# Altium schematic sheet 03_ARM_A.SchDoc: ARM Part A: EMIF / RAM
size 381 x 266 mm; Organization: Meteroi; Address1: Room 428, 410 Guiping Rd.; Address2: Shanghai 200233, CHINA; SheetNumber: 3; SheetTotal: 11; PageSetup: Record=PageOptions|CenterHorizontal=True|CenterVertical=True|PrintScale=0.75|XCorrection=1.00|YCorrection=1.00|PrintKind=2|BorderSize=5000000|LeftOffset=0|BottomOffset=0|Orientation=2|PaperLength=1000|PaperWidth=1000|Scale=100|PaperSource=276|PrintQuality=-3|MediaType=1|DitherType=10|PaperKind=A4|PrintScaleMode=1
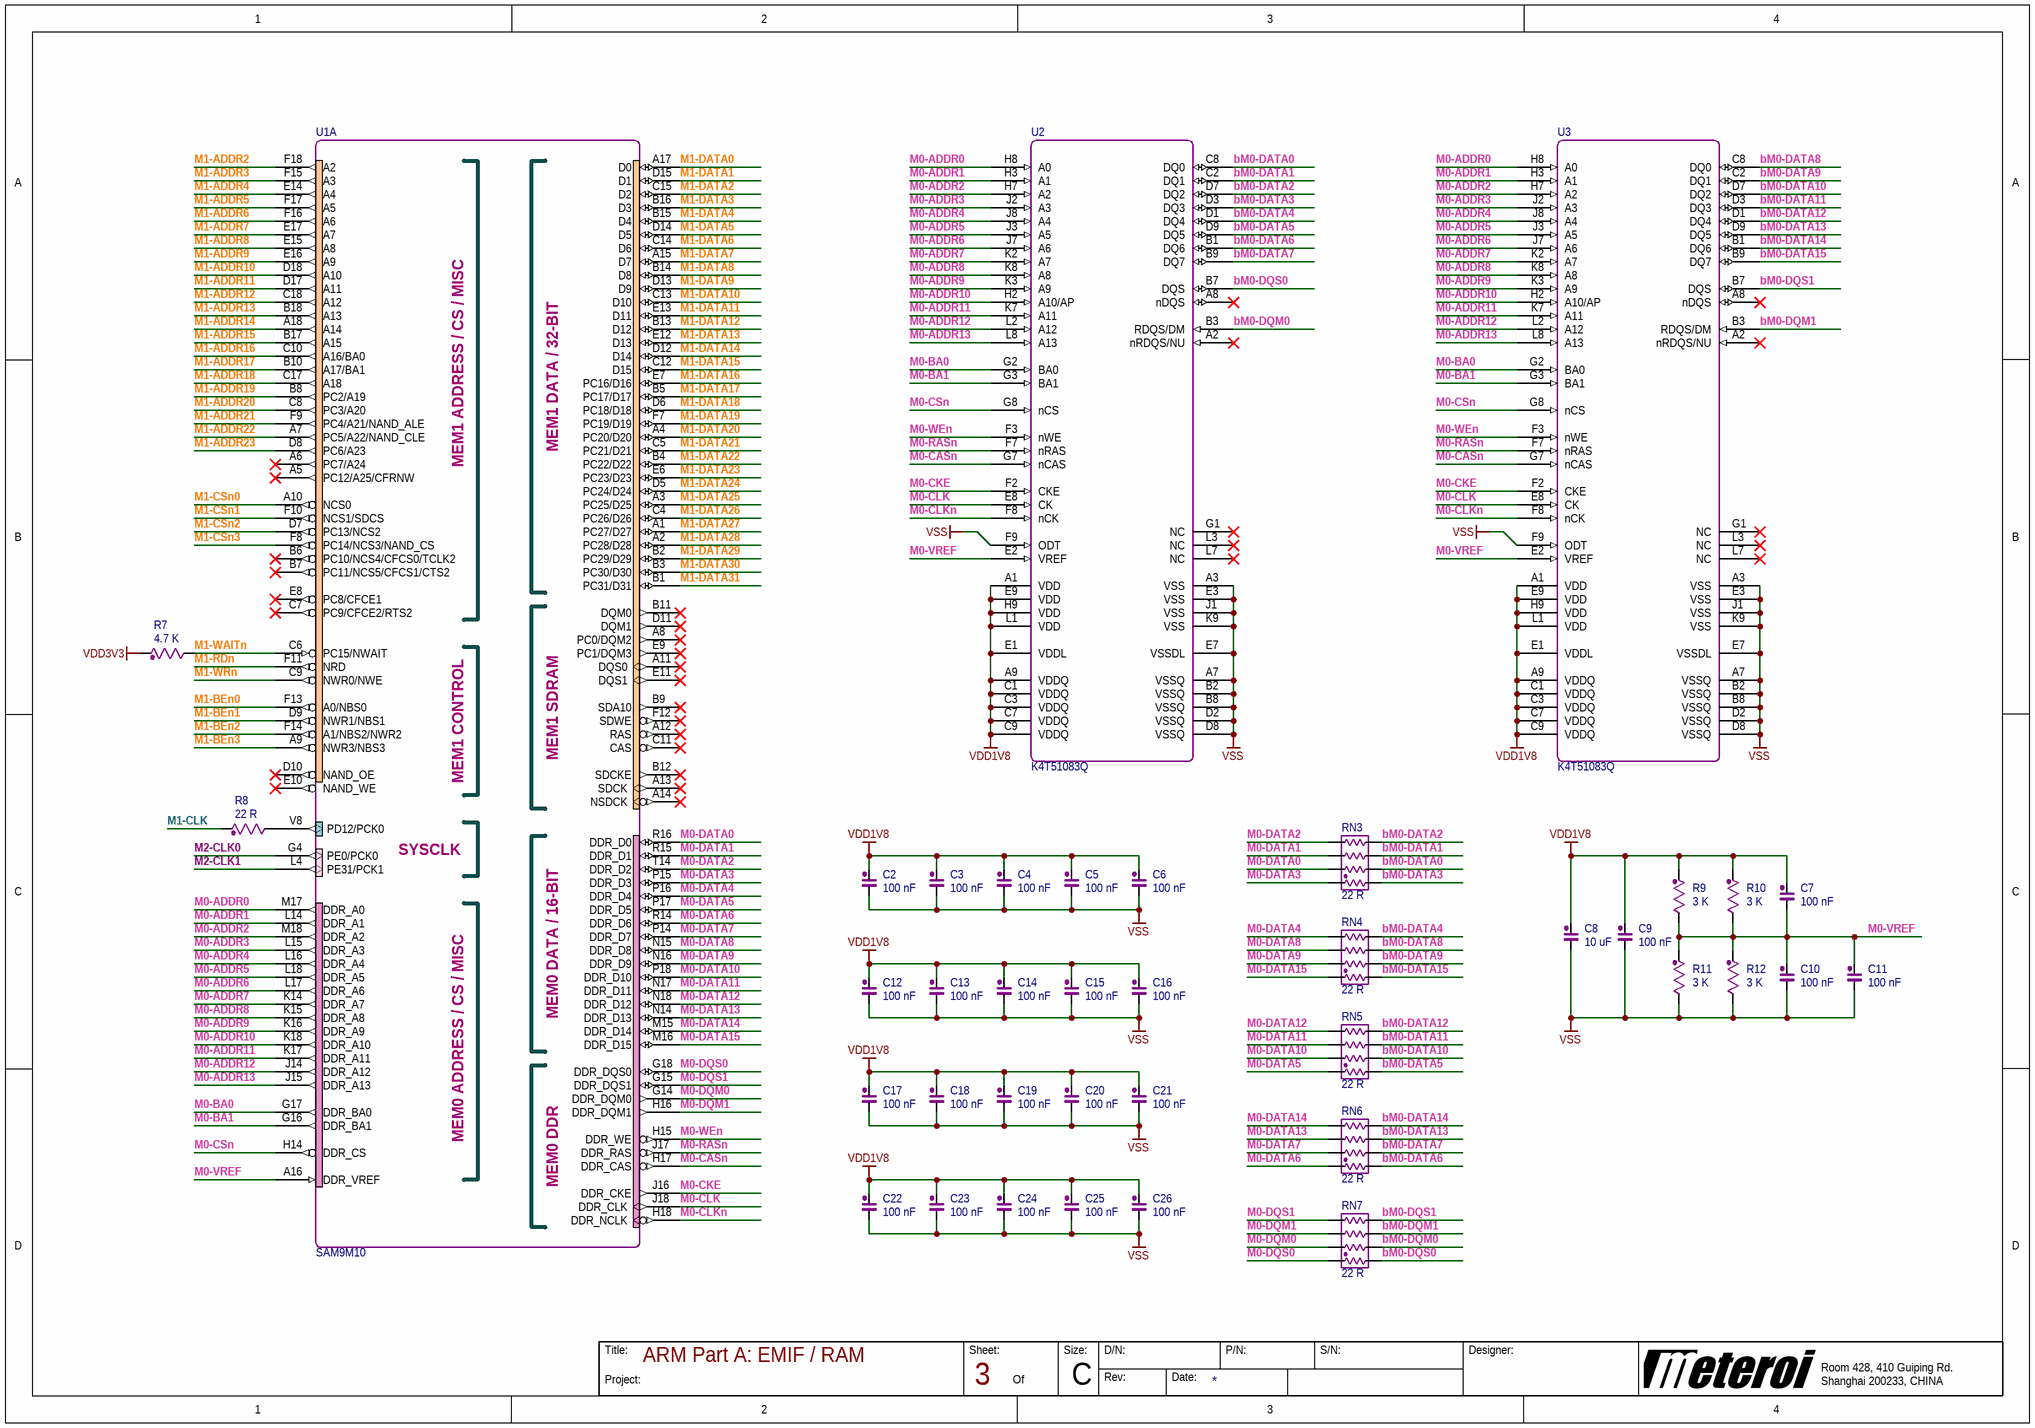
[diagram p0: 03_ARM_A.SchDoc]

## Parts
C2  100 nF  [0402A1]
C3  100 nF  [0402A1]
C4  100 nF  [0402A1]
C5  100 nF  [0402A1]
C6  100 nF  [0402A1]
C7  100 nF  [0402A1]
C8  10 uF  [0603A1]
C9  100 nF  [0402A1]
C10  100 nF  [0402A1]
C11  100 nF  [0402A1]
C12  100 nF  [0402A1]
C13  100 nF  [0402A1]
C14  100 nF  [0402A1]
C15  100 nF  [0402A1]
C16  100 nF  [0402A1]
C17  100 nF  [0402A1]
C18  100 nF  [0402A1]
C19  100 nF  [0402A1]
C20  100 nF  [0402A1]
C21  100 nF  [0402A1]
C22  100 nF  [0402A1]
C23  100 nF  [0402A1]
C24  100 nF  [0402A1]
C25  100 nF  [0402A1]
C26  100 nF  [0402A1]
R7  4.7 K  [0402A2]
R8  22 R  [0402A2]
R9  3 K  [0402A2]
R10  3 K  [0402A2]
R11  3 K  [0402A2]
R12  3 K  [0402A2]
RN3  22 R  [0402PR4]
RN4  22 R  [0402PR4]
RN5  22 R  [0402PR4]
RN6  22 R  [0402PR4]
RN7  22 R  [0402PR4]
U1  SAM9M10  [TFBGA-324]  (part A of 3)
U2  K4T51083Q  [FBGA-DDR-60]
U3  K4T51083Q  [FBGA-DDR-60]

## Nets
VDD1V8: C2.2 C3.2 C4.2 C5.2 C6.2 C7.2 C8.2 C9.2 C12.2 C13.2 C14.2 C15.2 C16.2 C17.2 C18.2 C19.2 C20.2 C21.2 C22.2 C23.2 C24.2 C25.2 C26.2 R9.2 R10.2 U2.A1(VDD) U2.A9(VDDQ) U2.C1(VDDQ) U2.C3(VDDQ) U2.C7(VDDQ) U2.C9(VDDQ) U2.E1(VDDL) U2.E9(VDD) U2.H9(VDD) U2.L1(VDD) U3.A1(VDD) U3.A9(VDDQ) U3.C1(VDDQ) U3.C3(VDDQ) U3.C7(VDDQ) U3.C9(VDDQ) U3.E1(VDDL) U3.E9(VDD) U3.H9(VDD) U3.L1(VDD)
VDD3V3: R7.2
VSS: C2.1 C3.1 C4.1 C5.1 C6.1 C8.1 C9.1 C10.1 C11.1 C12.1 C13.1 C14.1 C15.1 C16.1 C17.1 C18.1 C19.1 C20.1 C21.1 C22.1 C23.1 C24.1 C25.1 C26.1 R11.1 R12.1 U2.A3(VSS) U2.A7(VSSQ) U2.B2(VSSQ) U2.B8(VSSQ) U2.D2(VSSQ) U2.D8(VSSQ) U2.E3(VSS) U2.E7(VSSDL) U2.F9(ODT) U2.J1(VSS) U2.K9(VSS) U3.A3(VSS) U3.A7(VSSQ) U3.B2(VSSQ) U3.B8(VSSQ) U3.D2(VSSQ) U3.D8(VSSQ) U3.E3(VSS) U3.E7(VSSDL) U3.F9(ODT) U3.J1(VSS) U3.K9(VSS)
bM0-DATA0: RN3.4 U2.C8(DQ0)
bM0-DATA1: RN3.6 U2.C2(DQ1)
bM0-DATA2: RN3.8 U2.D7(DQ2)
bM0-DATA3: RN3.2 U2.D3(DQ3)
bM0-DATA4: RN4.8 U2.D1(DQ4)
bM0-DATA5: RN5.2 U2.D9(DQ5)
bM0-DATA6: RN6.2 U2.B1(DQ6)
bM0-DATA7: RN6.4 U2.B9(DQ7)
bM0-DATA8: RN4.6 U3.C8(DQ0)
bM0-DATA9: RN4.4 U3.C2(DQ1)
bM0-DATA10: RN5.4 U3.D7(DQ2)
bM0-DATA11: RN5.6 U3.D3(DQ3)
bM0-DATA12: RN5.8 U3.D1(DQ4)
bM0-DATA13: RN6.6 U3.D9(DQ5)
bM0-DATA14: RN6.8 U3.B1(DQ6)
bM0-DATA15: RN4.2 U3.B9(DQ7)
bM0-DQM0: RN7.4 U2.B3(RDQS/DM)
bM0-DQM1: RN7.6 U3.B3(RDQS/DM)
bM0-DQS0: RN7.2 U2.B7(DQS)
bM0-DQS1: RN7.8 U3.B7(DQS)
M0-ADDR0: U1.M17(DDR_A0) U2.H8(A0) U3.H8(A0)
M0-ADDR1: U1.L14(DDR_A1) U2.H3(A1) U3.H3(A1)
M0-ADDR2: U1.M18(DDR_A2) U2.H7(A2) U3.H7(A2)
M0-ADDR3: U1.L15(DDR_A3) U2.J2(A3) U3.J2(A3)
M0-ADDR4: U1.L16(DDR_A4) U2.J8(A4) U3.J8(A4)
M0-ADDR5: U1.L18(DDR_A5) U2.J3(A5) U3.J3(A5)
M0-ADDR6: U1.L17(DDR_A6) U2.J7(A6) U3.J7(A6)
M0-ADDR7: U1.K14(DDR_A7) U2.K2(A7) U3.K2(A7)
M0-ADDR8: U1.K15(DDR_A8) U2.K8(A8) U3.K8(A8)
M0-ADDR9: U1.K16(DDR_A9) U2.K3(A9) U3.K3(A9)
M0-ADDR10: U1.K18(DDR_A10) U2.H2(A10/AP) U3.H2(A10/AP)
M0-ADDR11: U1.K17(DDR_A11) U2.K7(A11) U3.K7(A11)
M0-ADDR12: U1.J14(DDR_A12) U2.L2(A12) U3.L2(A12)
M0-ADDR13: U1.J15(DDR_A13) U2.L8(A13) U3.L8(A13)
M0-BA0: U1.G17(DDR_BA0) U2.G2(BA0) U3.G2(BA0)
M0-BA1: U1.G16(DDR_BA1) U2.G3(BA1) U3.G3(BA1)
M0-CASn: U1.H17(DDR_CAS) U2.G7(nCAS) U3.G7(nCAS)
M0-CKE: U1.J16(DDR_CKE) U2.F2(CKE) U3.F2(CKE)
M0-CLK: U1.J18(DDR_CLK) U2.E8(CK) U3.E8(CK)
M0-CLKn: U1.H18(DDR_NCLK) U2.F8(nCK) U3.F8(nCK)
M0-CSn: U1.H14(DDR_CS) U2.G8(nCS) U3.G8(nCS)
M0-DATA0: RN3.3 U1.R16(DDR_D0)
M0-DATA1: RN3.5 U1.R15(DDR_D1)
M0-DATA2: RN3.7 U1.T14(DDR_D2)
M0-DATA3: RN3.1 U1.P15(DDR_D3)
M0-DATA4: RN4.7 U1.P16(DDR_D4)
M0-DATA5: RN5.1 U1.P17(DDR_D5)
M0-DATA6: RN6.1 U1.R14(DDR_D6)
M0-DATA7: RN6.3 U1.P14(DDR_D7)
M0-DATA8: RN4.5 U1.N15(DDR_D8)
M0-DATA9: RN4.3 U1.N16(DDR_D9)
M0-DATA10: RN5.3 U1.P18(DDR_D10)
M0-DATA11: RN5.5 U1.N17(DDR_D11)
M0-DATA12: RN5.7 U1.N18(DDR_D12)
M0-DATA13: RN6.5 U1.N14(DDR_D13)
M0-DATA14: RN6.7 U1.M15(DDR_D14)
M0-DATA15: RN4.1 U1.M16(DDR_D15)
M0-DQM0: RN7.3 U1.G14(DDR_DQM0)
M0-DQM1: RN7.5 U1.H16(DDR_DQM1)
M0-DQS0: RN7.1 U1.G18(DDR_DQS0)
M0-DQS1: RN7.7 U1.G15(DDR_DQS1)
M0-RASn: U1.J17(DDR_RAS) U2.F7(nRAS) U3.F7(nRAS)
M0-VREF: C7.1 C10.2 C11.2 R9.1 R10.1 R11.2 R12.2 U1.A16(DDR_VREF) U2.E2(VREF) U3.E2(VREF)
M0-WEn: U1.H15(DDR_WE) U2.F3(nWE) U3.F3(nWE)
M1-ADDR2: U1.F18(A2)
M1-ADDR3: U1.F15(A3)
M1-ADDR4: U1.E14(A4)
M1-ADDR5: U1.F17(A5)
M1-ADDR6: U1.F16(A6)
M1-ADDR7: U1.E17(A7)
M1-ADDR8: U1.E15(A8)
M1-ADDR9: U1.E16(A9)
M1-ADDR10: U1.D18(A10)
M1-ADDR11: U1.D17(A11)
M1-ADDR12: U1.C18(A12)
M1-ADDR13: U1.B18(A13)
M1-ADDR14: U1.A18(A14)
M1-ADDR15: U1.B17(A15)
M1-ADDR16: U1.C10(A16/BA0)
M1-ADDR17: U1.B10(A17/BA1)
M1-ADDR18: U1.C17(A18)
M1-ADDR19: U1.B8(PC2/A19)
M1-ADDR20: U1.C8(PC3/A20)
M1-ADDR21: U1.F9(PC4/A21/NAND_ALE)
M1-ADDR22: U1.A7(PC5/A22/NAND_CLE)
M1-ADDR23: U1.D8(PC6/A23)
M1-BEn0: U1.F13(A0/NBS0)
M1-BEn1: U1.D9(NWR1/NBS1)
M1-BEn2: U1.F14(A1/NBS2/NWR2)
M1-BEn3: U1.A9(NWR3/NBS3)
M1-CLK: R8.2
M1-CSn0: U1.A10(NCS0)
M1-CSn1: U1.F10(NCS1/SDCS)
M1-CSn2: U1.D7(PC13/NCS2)
M1-CSn3: U1.F8(PC14/NCS3/NAND_CS)
M1-DATA0: U1.A17(D0)
M1-DATA1: U1.D15(D1)
M1-DATA2: U1.C15(D2)
M1-DATA3: U1.B16(D3)
M1-DATA4: U1.B15(D4)
M1-DATA5: U1.D14(D5)
M1-DATA6: U1.C14(D6)
M1-DATA7: U1.A15(D7)
M1-DATA8: U1.B14(D8)
M1-DATA9: U1.D13(D9)
M1-DATA10: U1.C13(D10)
M1-DATA11: U1.E13(D11)
M1-DATA12: U1.B13(D12)
M1-DATA13: U1.E12(D13)
M1-DATA14: U1.D12(D14)
M1-DATA15: U1.C12(D15)
M1-DATA16: U1.E7(PC16/D16)
M1-DATA17: U1.B5(PC17/D17)
M1-DATA18: U1.D6(PC18/D18)
M1-DATA19: U1.F7(PC19/D19)
M1-DATA20: U1.A4(PC20/D20)
M1-DATA21: U1.C5(PC21/D21)
M1-DATA22: U1.B4(PC22/D22)
M1-DATA23: U1.E6(PC23/D23)
M1-DATA24: U1.D5(PC24/D24)
M1-DATA25: U1.A3(PC25/D25)
M1-DATA26: U1.C4(PC26/D26)
M1-DATA27: U1.A1(PC27/D27)
M1-DATA28: U1.A2(PC28/D28)
M1-DATA29: U1.B2(PC29/D29)
M1-DATA30: U1.B3(PC30/D30)
M1-DATA31: U1.B1(PC31/D31)
M1-RDn: U1.F11(NRD)
M1-WAITn: R7.1 U1.C6(PC15/NWAIT)
M1-WRn: U1.C9(NWR0/NWE)
M2-CLK0: U1.G4(PE0/PCK0)
M2-CLK1: U1.L4(PE31/PCK1)
NetR8_1: R8.1 U1.V8(PD12/PCK0)

Not connected (* = marked no-connect by the designer): U1 A5(PC12/A25/CFRNW)* A6(PC7/A24)* A8(PC0/DQM2)* A11(DQS0)* A12(RAS)* A13(SDCK)* A14(NSDCK)* B6(PC10/NCS4/CFCS0/TCLK2)* B7(PC11/NCS5/CFCS1/CTS2)* B9(SDA10)* B11(DQM0)* B12(SDCKE)* C7(PC9/CFCE2/RTS2)* C11(CAS)* D10(NAND_OE)* D11(DQM1)* E8(PC8/CFCE1)* E9(PC1/DQM3)* E10(NAND_WE)* E11(DQS1)* F12(SDWE)*; U2 A2(nRDQS/NU)* A8(nDQS)* G1(NC)* L3(NC)* L7(NC)*; U3 A2(nRDQS/NU)* A8(nDQS)* G1(NC)* L3(NC)* L7(NC)*

## Notes on the sheet
- Title:
- Project:
- Sheet:
- Of
- Size:
- D/N:
- Rev:
- Date:
- P/N:
- S/N:
- Designer:
- C
- (in symbol SAM9M10, part A) MEM1 ADDRESS / CS / MISC; MEM1 DATA / 32-BIT; MEM1 SDRAM; MEM1 CONTROL; SYSCLK; MEM0 DATA / 16-BIT; MEM0 ADDRESS / CS / MISC; MEM0 DDR

## Library data of the parts
C2-C7 C9-C26 = CAP: Normal Capacitor; PartNumber: 0; Vendor: muRata; Designer: shyul; PinCountSMD: 2; Value: 100 nF; SerialNumber: 0; Publisher: Cowin; PCBMarker: Capacitor; Version: 1.0; VersionDate: 04-27-2011; PinCountHole: 0
C8 = CAP: Normal Capacitor; PartNumber: 0; Value: 100 nF; Vendor: muRata; Designer: shyul; PinCountSMD: 2; SerialNumber: 0; Publisher: Cowin; PCBMarker: Capacitor; Version: 1.0; VersionDate: 04-27-2011; PinCountHole: 0
R7-R12 = RES: Normal Resistor; PartNumber: 0; Vendor: KOA; Designer: shyul; PinCountSMD: 2; SerialNumber: 0; Version: 1.0; VersionDate: 04-27-2011; PCBMarker: Resistor; Publisher: Cowin; PinCountHole: 0
  R7: Value: 4.7 K
  R8: Value: 22 R
  R9-R12: Value: 3 K
RN3-RN7 = RES_N4: Resistor Array x4; PartNumber: YC124-JR-0722RL; SerialNumber: 0; Vendor: YAGEO; Designer: shyul; PinCountSMD: 8; Value: 22 R; Version: 1.0; VersionDate: 04-27-2011; Publisher: Cowin; PCBMarker: Resistor Array; PinCountHole: 0
U1 = SAM9M10: SAM9M10 Embedded Processor; PartNumber: AT91SAM9M10-CU; PCBMarker: ARM9; SerialNumber: 0; Vendor: Atmel; Designer: shyul; Version: 1.0; VersionDate: 2-15-2012; Value: SAM9M10; Publisher: Cowin
U2 U3 = K4T51083Q: K4T51083Q 64M x8 DDR2 SDRAM; PartNumber: K4T51083QI-BCE7; SerialNumber: 0; Vendor: SUMSUNG; Designer: shyul; PCBMarker: DDR2; Version: 1.0; VersionDate: 2-16-2012; Value: K4T51083Q; Publisher: Cowin